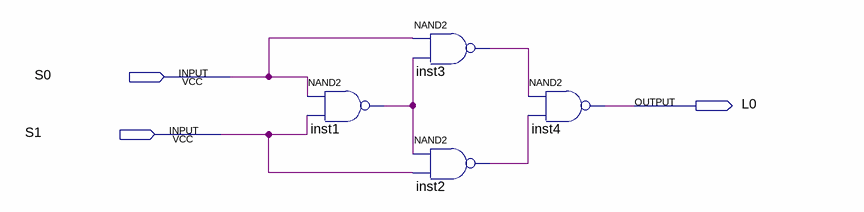
[diagram p0: schematic sheet]
// Quartus schematic exercise1.bdf as structural Verilog: 4 symbols, 3 pins
module exercise1 (
  input  S0,
  input  S1,
  output L0
);

  wire inst1_out, inst2_out, inst3_out;

  nand inst1 (inst1_out, S0, S1);
  nand inst3 (inst3_out, S0, inst1_out);
  nand inst2 (inst2_out, inst1_out, S1);
  nand inst4 (L0, inst3_out, inst2_out);
endmodule
